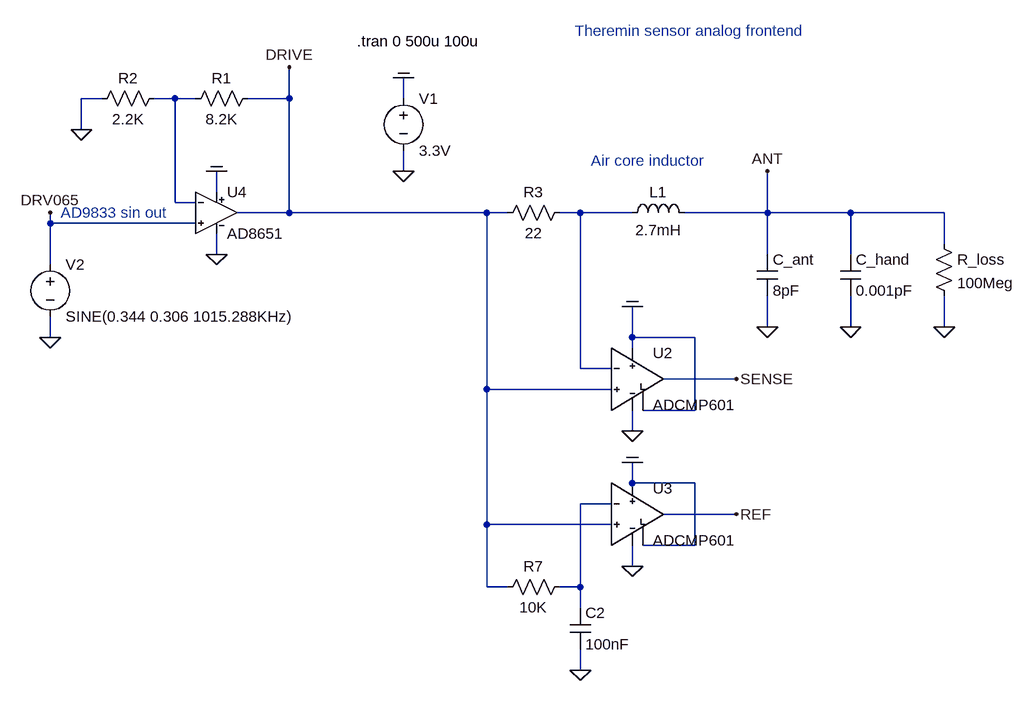
[diagram p0: schematic 2023_02_sine_drive_phase_shift.asc]
2023_02_sine_drive_phase_shift.asc, the LTspice schematic file:
Version 4
SHEET 1 2516 2820
WIRE 576 -112 544 -112
WIRE 688 -112 656 -112
WIRE 720 -112 688 -112
WIRE 864 -112 864 -160
WIRE 864 -112 800 -112
WIRE 1040 -112 1040 -144
WIRE 544 -64 544 -112
WIRE 1040 0 1040 -32
WIRE 752 32 752 0
WIRE 688 48 688 -112
WIRE 720 48 688 48
WIRE 864 64 864 -112
WIRE 864 64 784 64
WIRE 1168 64 864 64
WIRE 1200 64 1168 64
WIRE 1312 64 1280 64
WIRE 1392 64 1312 64
WIRE 1600 64 1600 0
WIRE 1600 64 1472 64
WIRE 1728 64 1600 64
WIRE 1872 64 1728 64
WIRE 496 80 496 64
WIRE 720 80 496 80
WIRE 1872 112 1872 64
WIRE 752 128 752 96
WIRE 1600 128 1600 64
WIRE 1728 128 1728 64
WIRE 496 144 496 80
WIRE 1600 240 1600 192
WIRE 1728 240 1728 192
WIRE 1872 240 1872 192
WIRE 496 256 496 224
WIRE 1392 256 1392 208
WIRE 1488 256 1392 256
WIRE 1392 272 1392 256
WIRE 1312 304 1312 64
WIRE 1360 304 1312 304
WIRE 1552 320 1440 320
WIRE 1168 336 1168 64
WIRE 1360 336 1168 336
WIRE 1488 368 1488 256
WIRE 1488 368 1408 368
WIRE 1392 400 1392 368
WIRE 1392 480 1392 448
WIRE 1488 480 1392 480
WIRE 1360 512 1312 512
WIRE 1552 528 1440 528
WIRE 1168 544 1168 336
WIRE 1360 544 1168 544
WIRE 1488 576 1488 480
WIRE 1488 576 1408 576
WIRE 1392 608 1392 576
WIRE 1168 640 1168 544
WIRE 1200 640 1168 640
WIRE 1312 640 1312 512
WIRE 1312 640 1280 640
WIRE 1312 672 1312 640
WIRE 1312 768 1312 736
FLAG 1040 0 0
FLAG 1040 -144 COM
FLAG 496 256 0
FLAG 496 64 DRV065
FLAG 544 -64 0
FLAG 864 -160 DRIVE
FLAG 1600 240 0
FLAG 1600 0 ANT
FLAG 1728 240 0
FLAG 1872 240 0
FLAG 1392 208 COM
FLAG 1392 400 0
FLAG 1552 320 SENSE
FLAG 1392 448 COM
FLAG 1392 608 0
FLAG 1552 528 REF
FLAG 1312 768 0
FLAG 752 0 COM
FLAG 752 128 0
SYMBOL voltage 1040 -128 R0
WINDOW 123 0 0 Left 0
WINDOW 39 0 0 Left 0
SYMATTR InstName V1
SYMATTR Value 3.3V
SYMBOL voltage 496 128 R0
WINDOW 123 0 0 Left 0
WINDOW 39 0 0 Left 0
SYMATTR InstName V2
SYMATTR Value SINE(0.344 0.306 1015.288KHz)
SYMBOL res 816 -128 R90
WINDOW 0 0 56 VBottom 2
WINDOW 3 32 56 VTop 2
SYMATTR InstName R1
SYMATTR Value 8.2K
SYMBOL res 672 -128 R90
WINDOW 0 0 56 VBottom 2
WINDOW 3 32 56 VTop 2
SYMATTR InstName R2
SYMATTR Value 2.2K
SYMBOL res 1296 48 R90
WINDOW 0 0 56 VBottom 2
WINDOW 3 32 56 VTop 2
SYMATTR InstName R3
SYMATTR Value 22
SYMBOL ind 1376 80 R270
WINDOW 0 32 56 VTop 2
WINDOW 3 5 56 VBottom 2
SYMATTR InstName L1
SYMATTR Value 2.7mH
SYMATTR SpiceLine Ipk=0.5 Rser=120 Cpar=1.1pF
SYMBOL cap 1584 128 R0
SYMATTR InstName C_ant
SYMATTR Value 8pF
SYMBOL cap 1712 128 R0
SYMATTR InstName C_hand
SYMATTR Value 0.001pF
SYMBOL res 1856 96 R0
WINDOW 0 36 40 Left 2
WINDOW 3 36 76 Left 2
SYMATTR InstName R_loss
SYMATTR Value 100Meg
SYMBOL adcmp601 1392 320 R0
SYMATTR InstName U2
SYMBOL adcmp601 1392 528 R0
SYMATTR InstName U3
SYMBOL res 1296 624 R90
WINDOW 0 0 56 VBottom 2
WINDOW 3 32 56 VTop 2
SYMATTR InstName R7
SYMATTR Value 10K
SYMBOL cap 1296 672 R0
SYMATTR InstName C2
SYMATTR Value 100nF
SYMBOL ad8651 752 0 R0
SYMATTR InstName U4
TEXT 968 -200 Left 2 !.tran 0 500u 100u
TEXT 1328 -16 Left 2 ;Air core inductor
TEXT 1304 -216 Left 2 ;Theremin sensor analog frontend
TEXT 512 64 Left 2 ;AD9833 sin out

The netlist it stands for:
* 2023_02_sine_drive_phase_shift.asc
V1 COM 0 3.3V
V2 DRV065 0 SINE(0.344 0.306 1015.288KHz)
R1 DRIVE N001 8.2K
R2 N001 0 2.2K
R3 N002 DRIVE 22
L1 N002 ANT 2.7mH Ipk=0.5 Rser=120 Cpar=1.1pF
C_ant ANT 0 8pF
C_hand ANT 0 0.001pF
R_loss ANT 0 100Meg
XU2 DRIVE N002 COM COM 0 SENSE ADCMP601  ; pins In+ In- LATCH VCC VEE OUT+
XU3 DRIVE N003 COM COM 0 REF ADCMP601  ; pins In+ In- LATCH VCC VEE OUT+
R7 N003 DRIVE 10K
C2 N003 0 100nF
XU4 DRV065 N001 COM 0 DRIVE AD8651  ; pins In+ In- V+ V- OUT
.tran 0 500u 100u
* Air core inductor
* Theremin sensor analog frontend
* AD9833 sin out
.lib adcmp601.cir
.lib ad8651.cir
.backanno
.end